# Altium schematic sheet MainProjSheet.SchDoc: 系统框图
size A4; DocumentNumber: 00
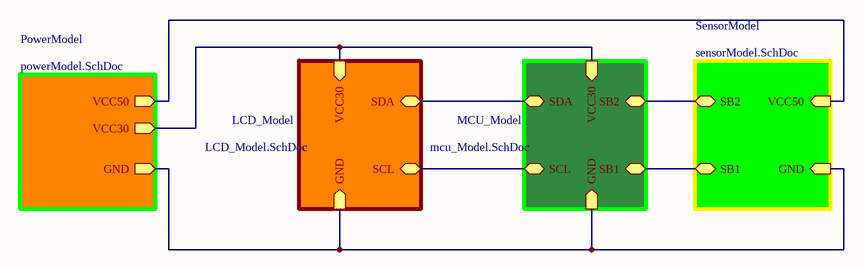
[diagram p0: MainProjSheet.SchDoc]

## Sub-sheets
LCD_Model = LCD_Model.SchDoc: GND (in), VCC30 (in), SCL, SDA
MCU_Model = mcu_Model.SchDoc: VCC30 (in), GND (in), SB1 (bidir), SB2 (bidir), SCL (bidir), SDA (bidir)
PowerModel = powerModel.SchDoc: VCC50 (out), GND (out), VCC30 (out)
SensorModel = sensorModel.SchDoc: VCC50 (in), GND (in), SB1 (bidir), SB2 (bidir)

## Nets
(unnamed): sheet PowerModel/VCC50, sheet SensorModel/VCC50
(unnamed): sheet PowerModel/GND, sheet MCU_Model/GND, sheet SensorModel/GND, sheet LCD_Model/GND
(unnamed): sheet PowerModel/VCC30, sheet MCU_Model/VCC30, sheet LCD_Model/VCC30
(unnamed): sheet MCU_Model/SB1, sheet SensorModel/SB1
(unnamed): sheet MCU_Model/SB2, sheet SensorModel/SB2
(unnamed): sheet MCU_Model/SCL, sheet LCD_Model/SCL
(unnamed): sheet MCU_Model/SDA, sheet LCD_Model/SDA

## Notes on the sheet
- Title
- Size:
- Date:
- A4
- Number:
- Time:
- Revision:
- Sheet
- of
- File: